# EAGLE design 32u4_Gripper_2015_A (EAGLE 6.5.0)
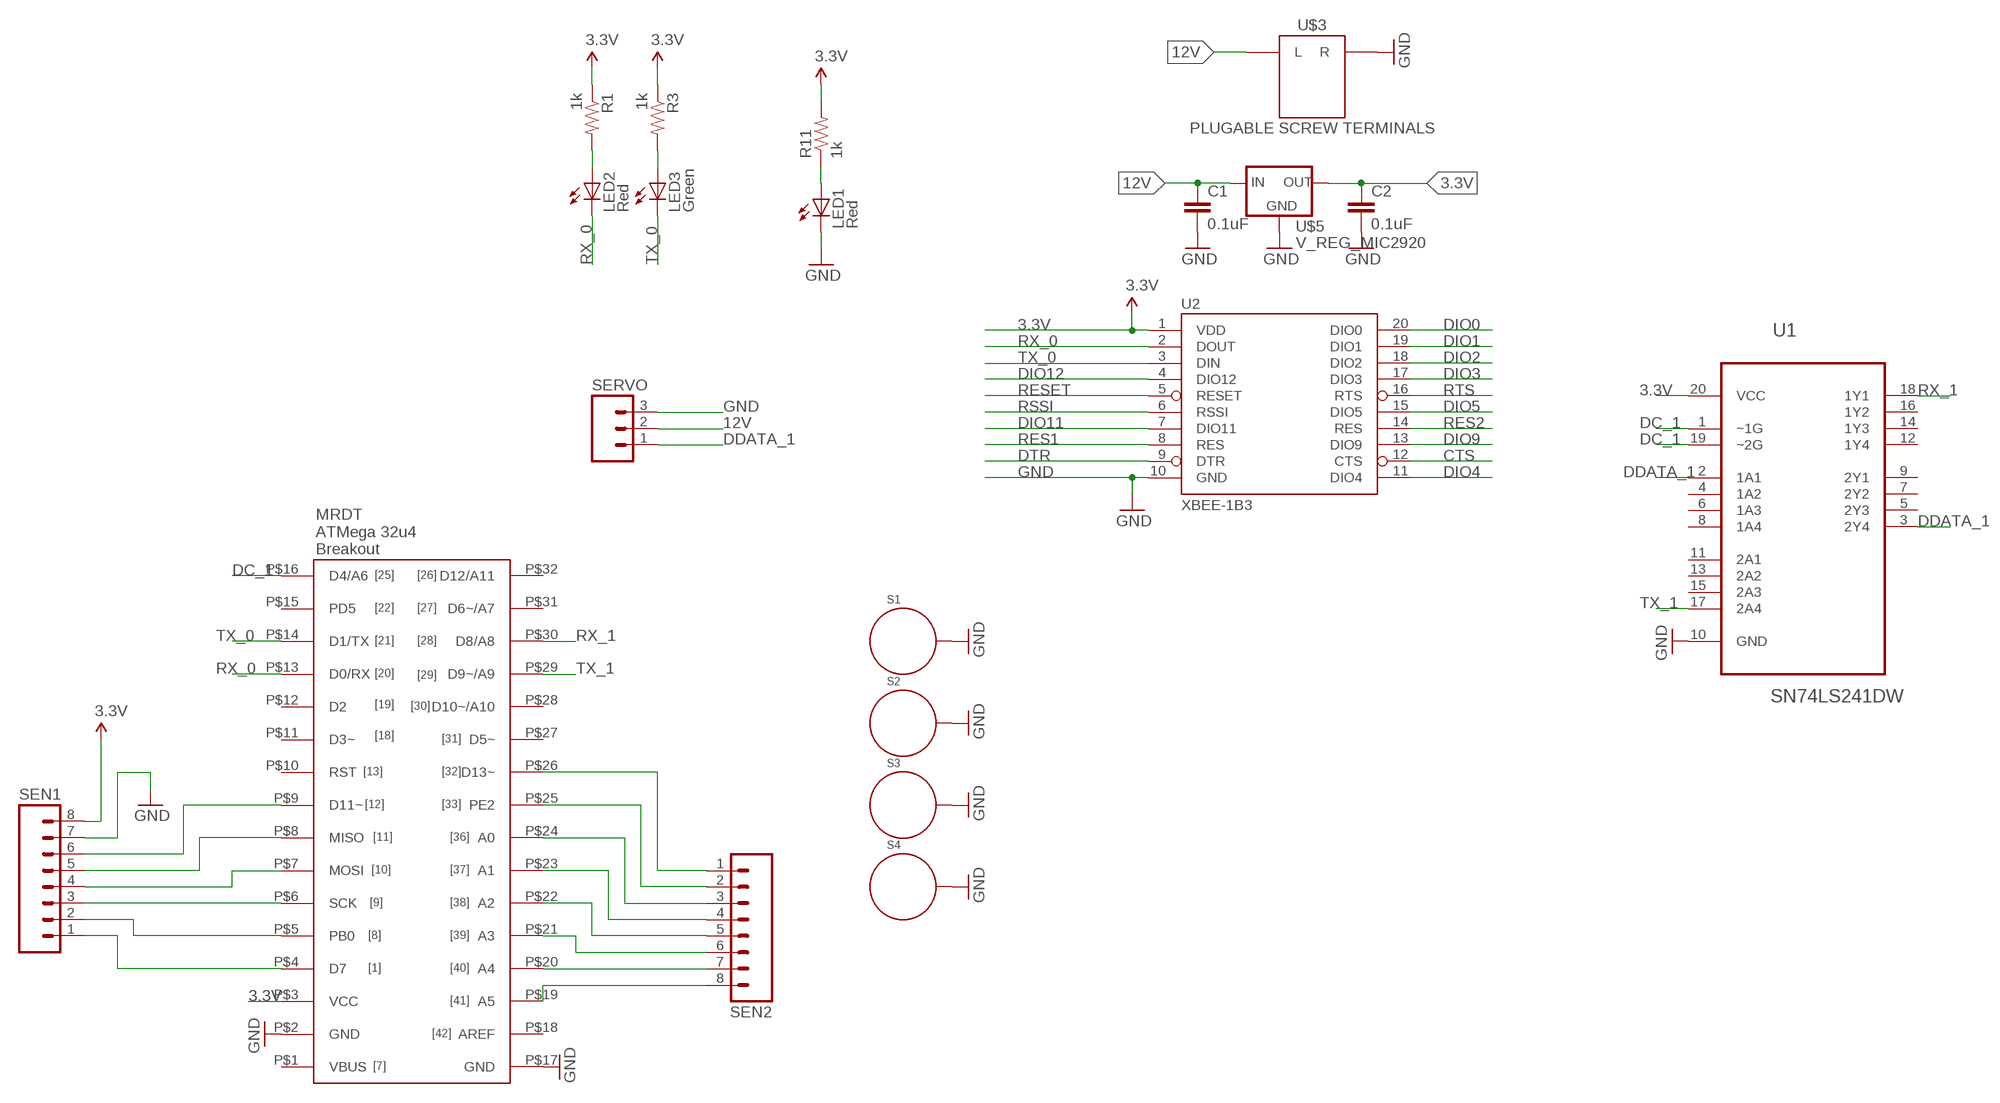
[diagram p0: schematic, sheet 1]

## Parts
C1  0.1uF  CAP1206  [1206]
C2  0.1uF  CAP1206  [1206]
LED1  Red  LED0603  [LED-0603]
LED2  Red  LED0603  [LED-0603]
LED3  Green  LED0603  [LED-0603]
R1  1k  RESISTOR1206  [1206]
R3  1k  RESISTOR1206  [1206]
R11  1k  RESISTOR1206  [1206]
S1  STANDOFF_ELECTRICAL  [STANDOFF-ELECTRICAL]
S2  STANDOFF_ELECTRICAL  [STANDOFF-ELECTRICAL]
S3  STANDOFF_ELECTRICAL  [STANDOFF-ELECTRICAL]
S4  STANDOFF_ELECTRICAL  [STANDOFF-ELECTRICAL]
SEN1  M081X08  [1X08]
SEN2  M081X08  [1X08]
SERVO  M03PTH  [1X03]
U1  SN74LS241DW  [SOIC127P1030X265-20N]
U2  XBEE-1B3  [XBEE-SMD]
U$1  32U4_BREAKOU_SMD  [32U3_MCU_DIP_SMD]
U$3  PLUGABLE SCREW TERMINALS  H_WR-TBL_3210002VERT  [691321100002]
U$5  V_REG_MIC2920  [SOT223]

## Nets
3.3V [vcc]: C2.1 R1.1 R3.1 R11.2 SEN1.8 U1.20(VCC) U2.1(VDD) U$1.P$3(VCC) U$5.3(OUT)
12V: C1.1 SERVO.2 U$3.L U$5.1(IN)
CTS: U2.12(CTS)
DC_1: U1.1(~1G) U1.19(~2G) U$1.P$16(D4/A6)
DDATA_1: SERVO.1 U1.2(1A1) U1.3(2Y4)
DIO0: U2.20(DIO0)
DIO1: U2.19(DIO1)
DIO2: U2.18(DIO2)
DIO3: U2.17(DIO3)
DIO4: U2.11(DIO4)
DIO5: U2.15(DIO5)
DIO9: U2.13(DIO9)
DIO11: U2.7(DIO11)
DIO12: U2.4(DIO12)
DTR: U2.9(DTR)
GND: C1.2 C2.2 LED1.C S1.P1 S2.P1 S3.P1 S4.P1 SEN1.7 SERVO.3 U1.10(GND) U2.10(GND) U$1.P$2(GND) U$1.P$17(GND) U$3.R U$5.2(GND) U$5.4(GND)
N$1: LED2.A R1.2
N$2: SEN1.1 U$1.P$4(D7)
N$3: SEN1.2 U$1.P$5(PB0)
N$4: LED3.A R3.2
N$5: SEN1.3 U$1.P$6(SCK)
N$6: SEN1.4 U$1.P$7(MOSI)
N$7: SEN1.5 U$1.P$8(MISO)
N$8: SEN1.6 U$1.P$9(D11~)
N$11: SEN2.8 U$1.P$19(A5)
N$12: SEN2.7 U$1.P$20(A4)
N$13: SEN2.6 U$1.P$21(A3)
N$14: SEN2.5 U$1.P$22(A2)
N$15: SEN2.3 U$1.P$24(A0)
N$16: SEN2.4 U$1.P$23(A1)
N$17: SEN2.2 U$1.P$25(PE2)
N$18: SEN2.1 U$1.P$26(D13~)
N$38: LED1.A R11.1
RES1: U2.8(RES)
RES2: U2.14(RES)
RESET: U2.5(RESET)
RSSI: U2.6(RSSI)
RTS: U2.16(RTS)
RX_0: LED2.C U2.2(DOUT) U$1.P$13(D0/RX)
RX_1: U1.18(1Y1) U$1.P$30(D8/A8)
TX_0: LED3.C U2.3(DIN) U$1.P$14(D1/TX)
TX_1: U1.17(2A4) U$1.P$29(D9~/A9)
Unconnected: U1.4(1A2) U1.5(2Y3) U1.6(1A3) U1.7(2Y2) U1.8(1A4) U1.9(2Y1) U1.11(2A1) U1.12(1Y4) U1.13(2A2) U1.14(1Y3) U1.15(2A3) U1.16(1Y2) U$1.P$1(VBUS) U$1.P$10(RST) U$1.P$11(D3~) U$1.P$12(D2) U$1.P$15(PD5) U$1.P$18(AREF) U$1.P$27(D5~) U$1.P$28(D10~/A10) U$1.P$31(D6~/A7) U$1.P$32(D12/A11)

## Library data of the parts
C1 C2 = SparkFun-Passives:CAP: Capacitor Standard 0603 ceramic capacitor, and 0.1" leaded capacitor.
LED1-LED3 = SparkFun:LED: LEDs Standard schematic elements and footprints for 5mm, 3mm, 1206, and 0603 sized LEDs. 5mm - Spark Fun Electronics SKU : COM-00529 (and others)
R1 R3 R11 = SparkFun-Passives:RESISTOR: Resistor Basic schematic elements and footprints for 0603, 1206, and PTH resistors.
S1-S4 = SparkFun-Electromechanical:STANDOFF_ELECTRICAL: A standoff intended to be an electrically connected point. Pad size and stop size allow for a #4 Phillips pan screw head to make a solid connection to the board.
SEN1 SEN2 = SparkFun-Connectors:M08: Header 8 Standard 8-pin 0.1" header. Use with straight break away headers (SKU : PRT-00116), right angle break away headers (PRT-00553), swiss pins (PRT-00743), machine pins (PRT-00117), and female headers (PRT-00115).
SERVO = SparkFun-Connectors:M03: Header 3 Standard 3-pin 0.1" header. Use with straight break away headers (SKU : PRT-00116), right angle break away headers (PRT-00553), swiss pins (PRT-00743), machine pins (PRT-00117), and female headers (PRT-00115). Molex polarized connector foot print use with SKU : PRT-08232 with associated crimp pins and housings.
U1 = 74LS241:SN74LS241DW: OCTAL BUFFERS AND LINE DRIVERS WITH 3-STATE OUTPUTS; MPN: SN74LS241DW; OC_FARNELL: 1739687; OC_NEWARK: 50R6539; PACKAGE: SOIC-20; SUPPLIER: Texas Instruments
U2 = SparkFun:XBEE-1
U$1 = MRDT-2015-General:32U4_BREAKOU_SMD
U$3 = MRDT-2015-PowerBoard:H_WR-TBL_32*1*0002: Wurth Electronic's 2-pin 10A pluggable screw terminal headers. Vertical and Horizantal Part Numbers: 691322110002 (Horizantal) 691321100002 (Vertical); DIGIKEY_PN: 732-2763-ND
U$5 = SparkFun-PowerIC:V_REG_MIC2920: MIC2920A (http://www.micrel.com/_PDF/mic2920.pdf) - 400mA output LDO Regulator

## Net classes
1 vcc: width 0.305 mm

## Board
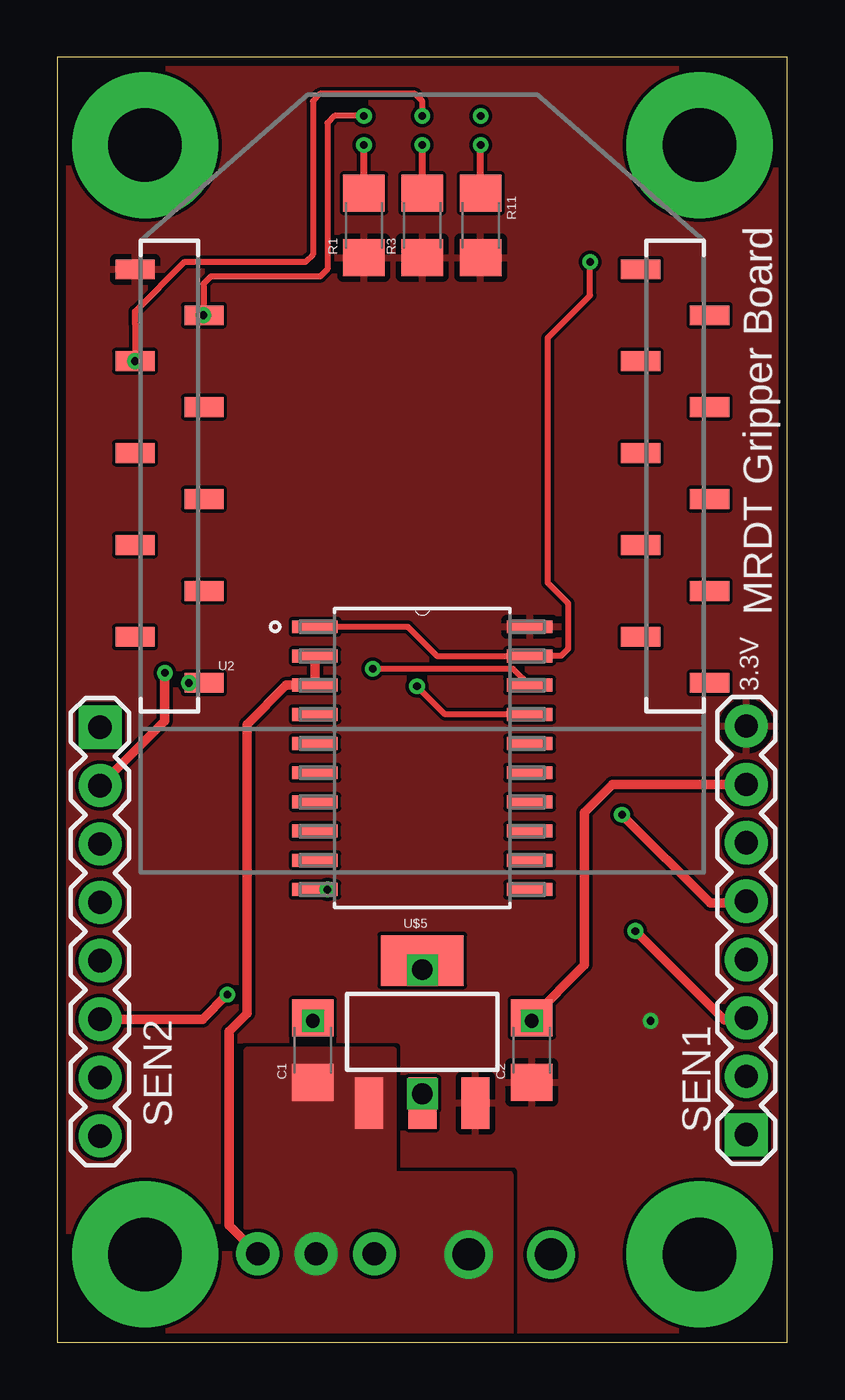
[diagram p1: board, top side]
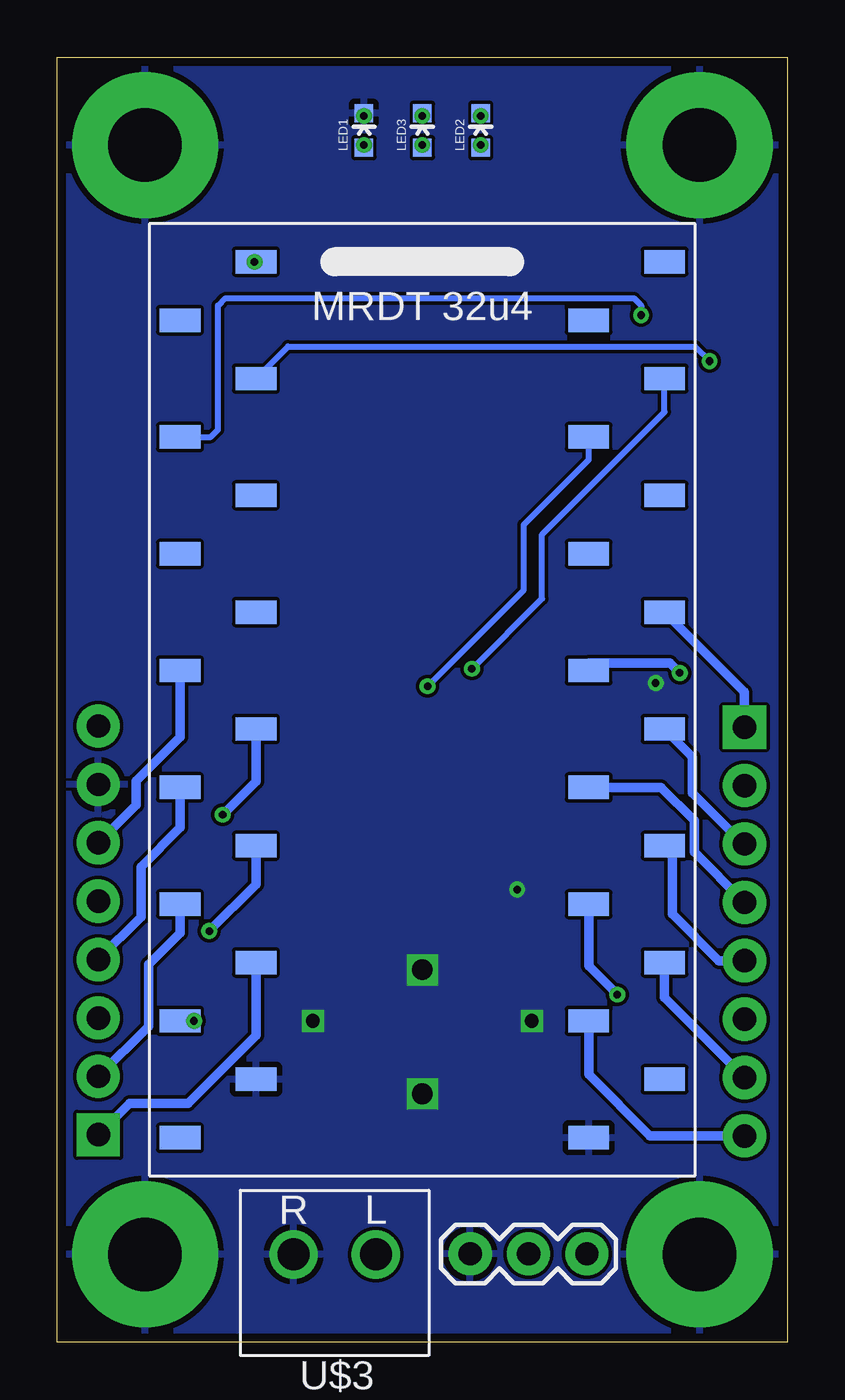
[diagram p2: board, bottom side, seen from below]

Size 31.75 x 55.88 mm. Coordinates in mm from the lower left corner, seen from the top.
Outline: 0,0 31.75,0 31.75,55.88 0,55.88 0,0
Copper layers (1*16): Top 0.0356mm / dielectric 1.5011mm / Bottom 0.0356mm
Design rules "LaenPCBOrder": minimum track width 6mil, minimum drill 13mil, track to track 6mil, track to pad 6mil, pad to pad 6mil, via to via 6mil, smd to smd 6mil, copper to edge 15mil, drill to drill 6mil, minimum pad ring 7mil, minimum via ring 7mil, stop-mask expansion 3mil, vias tented up to drill 0mil, thermal gap 10mil

### Footprints (pad centres in the part's own frame; a part is rotated, then mirrored left to right if it is on the bottom)
1206 = smd 1.6 x 1.8: 1 -1.4,0; 2 1.4,0
LED-0603 = smd 0.8 x 0.8: A 0,-0.75; C 0,0.75
STANDOFF-ELECTRICAL = drill 3.2 pad 6.35: P1 0,0
1X08 = drill 1.016 pad 1.88 square: 1 0,0 | drill 1.016 pad 1.88: 2 2.54,0; 3 5.08,0; 4 7.62,0; 5 10.16,0; 6 12.7,0; 7 15.24,0; 8 17.78,0
1X03 = drill 1.016 pad 1.88: 1 0,0; 2 2.54,0; 3 5.08,0
SOIC127P1030X265-20N = smd 1.981 x 0.559: 1 -4.674,5.715; 2 -4.674,4.445; 3 -4.674,3.175; 4 -4.674,1.905; 5 -4.674,0.635; 6 -4.674,-0.635; 7 -4.674,-1.905; 8 -4.674,-3.175; 9 -4.674,-4.445; 10 -4.674,-5.715; 11 4.674,-5.715; 12 4.674,-4.445; 13 4.674,-3.175; 14 4.674,-1.905; 15 4.674,-0.635; 16 4.674,0.635; 17 4.674,1.905; 18 4.674,3.175; 19 4.674,4.445; 20 4.674,5.715
XBEE-SMD = smd 1.7 x 0.85: 1 -12.5,20; 2 -9.5,18; 3 -12.5,16; 4 -9.5,14; 5 -12.5,12; 6 -9.5,10; 7 -12.5,8; 8 -9.5,6; 9 -12.5,4; 10 -9.5,2; 11 12.5,2; 12 9.5,4; 13 12.5,6; 14 9.5,8; 15 12.5,10; 16 9.5,12; 17 12.5,14; 18 9.5,16; 19 12.5,18; 20 9.5,20
32U3_MCU_DIP_SMD = smd 1.778 x 1.016: P$1 -10.541,-19.05; P$2 -7.239,-16.51; P$3 -10.541,-13.97; P$4 -7.239,-11.43; P$5 -10.541,-8.89; P$6 -7.239,-6.35; P$7 -10.541,-3.81; P$8 -7.239,-1.27; P$9 -10.541,1.27; P$10 -7.239,3.81; P$11 -10.541,6.35; P$12 -7.239,8.89; P$13 -10.541,11.43; P$14 -7.239,13.97; P$15 -10.541,16.51; P$16 -7.239,19.05; P$17 7.239,-19.05; P$18 10.541,-16.51; P$19 7.239,-13.97; P$20 10.541,-11.43; P$21 7.239,-8.89; P$22 10.541,-6.35; P$23 7.239,-3.81; P$24 10.541,-1.27; P$25 7.239,1.27; P$26 10.541,3.81; P$27 7.239,6.35; P$28 10.541,8.89; P$29 7.239,11.43; P$30 10.541,13.97; P$31 7.239,16.51; P$32 10.541,19.05
691321100002 = drill 1.4: L -1.79,0; R 1.79,0
SOT223 = smd 1.219 x 2.235: 1 -2.311,-3.099; 2 0,-3.099; 3 2.311,-3.099 | smd 3.6 x 2.2: 4 0,3.099

### Placement (x,y rotation side)
C1  11.11,12.7 90 top
C2  20.64,12.7 90 top
LED1  18.41,52.7 0 bottom
LED2  13.34,52.7 0 bottom
LED3  15.88,52.7 0 bottom
R1  13.34,48.58 90 top
R3  15.88,48.58 90 top
R11  18.41,48.58 270 top
S1  3.81,52.07 0 top
S2  27.94,52.07 0 top
S3  3.81,3.81 0 top
S4  27.94,3.81 0 top
SEN1  29.97,9.02 90 top
SEN2  1.85,26.75 270 top
SERVO  8.71,3.84 180 bottom
U1  15.88,25.4 0 top
U2  15.88,26.67 0 top
U$1  15.88,27.94 0 bottom
U$3  19.68,3.81 180 bottom
U$5  15.88,13.49 0 top

### Tracks (layer width: path | path; a pad name or v marks a point on that pad's centre or on a via)
3.3V  (via drill 0.33)
  Bottom 0.305: v25.81,13.97 U$1.P$3
  pour Top (isolate 0.152, rank 2): -1.27,-1.27 -1.27,57.15 33.02,57.15 33.02,-1.27
12V
  pour Top (isolate 0.152, no thermals): 0,0 0,3.81 8.26,3.81 8.26,12.7 14.61,12.7 14.61,7.3 19.68,7.3 19.68,0
DC_1  (via drill 0.33)
  Top 0.254: U1.1 15.24,31.11 16.51,29.84 U1.19 21.91,29.84 22.23,30.16 22.23,32.13 21.34,33.02 21.34,43.69 23.18,45.53 v23.18,46.99
  Bottom 0.254: v23.18,46.99 23.18,46.93 U$1.P$16
DDATA_1
  Top 0.406: U1.2 U1.3 9.96,28.57 8.26,26.87 8.26,14.3 7.47,13.51 7.47,5.08 SERVO.1
GND  (via drill 0.33, 0.6, 0.9)
  Top 0.406: U2.10 v5.71,28.67 | U1.10 v11.75,19.68 | 14.92,16.19 14.92,16.51 15.24,16.51 15.24,16.59 U$5.4 v15.88,16.19 | U$5.2 v15.88,10.79 | C1.2 v11.11,13.97 | v20.64,13.97 C2.2 22.94,16.4 22.94,23.04 24.16,24.26 SEN1.7
  Bottom 0.406: LED1.C v18.41,53.34
  pour Bottom (isolate 0.152): -3.81,-2.54 -3.81,58.42 35.56,58.42 35.56,-2.54
N$1  (via drill 0.33)
  Top 0.305: R1.2 v13.34,52.07
  Bottom 0.305: v13.34,52.07 LED2.A
N$2
  Bottom 0.406: U$1.P$4 23.11,13.34 26.06,10.39 28.6,10.39 SEN1.1
N$3
  Bottom 0.406: SEN1.2 27.79,13.74 27.79,16.43 26.42,17.8 U$1.P$5
N$4  (via drill 0.33)
  Top 0.305: R3.2 v15.88,52.07
  Bottom 0.305: v15.88,52.07 LED3.A
N$5  (via drill 0.33)
  Top 0.406: v25.15,17.88 29.01,14.02 29.9,14.02 SEN1.3
  Bottom 0.406: v25.15,17.88 23.11,19.91 U$1.P$6
N$6
  Bottom 0.406: U$1.P$7 26.42,22.38 28.12,20.68 28.12,18.49 SEN1.4
N$7  (via drill 0.33)
  Top 0.406: v24.56,22.94 28.4,19.1 29.9,19.1 SEN1.5
  Bottom 0.406: 23.09,26.64 U$1.P$8 23.11,24.38 v24.56,22.94
N$8
  Bottom 0.406: U$1.P$9 26.42,26.31 28.32,24.41 28.32,23.37 SEN1.6
N$11
  Bottom 0.406: SEN2.8 5.97,8.97 8.64,11.63 U$1.P$19
N$12
  Bottom 0.406: SEN2.7 5.33,14.99 U$1.P$20
N$13  (via drill 0.33)
  Top 0.406: v7.39,15.11 6.33,14.05 SEN2.6
  Bottom 0.406: U$1.P$21 8.64,16.36 v7.39,15.11
N$14
  Bottom 0.406: SEN2.5 2.97,16.59 5,18.62 5,21.26 U$1.P$22
N$15
  Bottom 0.406: U$1.P$24 4.12,25.45 4.12,23.88 1.91,21.67 SEN2.3
N$16
  Bottom 0.406: U$1.P$23 5.49,24.13 4.04,22.68 4.04,21.31 SEN2.4
N$17  (via drill 0.33)
  Top 0.406: SEN2.2 4.67,27.03 v4.67,29.11
  Bottom 0.406: U$1.P$25 8.64,29.54 5.11,29.54 v4.67,29.11
N$18
  Bottom 0.406: U$1.P$26 1.85,28.27 SEN2.1
N$38  (via drill 0.33)
  Top 0.305: R11.1 v18.41,52.07
  Bottom 0.305: v18.41,52.07 LED1.A
RX_0  (via drill 0.33)
  Top 0.254: v6.35,44.67 U2.2 6.35,44.7 6.35,46.04 6.67,46.35 11.43,46.35 11.75,46.67 11.75,53.02 12.06,53.34 v13.34,53.34
  Bottom 0.254: U$1.P$13 25.08,39.37 24.77,39.69 24.77,45.09 24.45,45.4 6.67,45.4 6.35,45.09 v6.35,44.67 | LED2.C 13.13,53.45 v13.34,53.34
RX_1  (via drill 0.33)
  Top 0.254: U1.18 19.84,29.29 v13.72,29.29
  Bottom 0.254: v13.72,29.29 10.67,32.33 10.67,35.13 5.33,40.46 U$1.P$30
TX_0  (via drill 0.33)
  Top 0.254: 3.5,42.55 U2.3 3.38,44.29 3.38,44.3 3.38,44.83 5.54,46.99 10.79,46.99 11.11,47.31 11.11,53.98 11.43,54.29 15.56,54.29 15.88,53.98 v15.88,53.34
  Bottom 0.254: 23.11,42.29 U$1.P$14 21.72,43.31 4.01,43.31 U2.3 | LED3.C v15.88,53.34
  other vias: 3.38,42.67
TX_1  (via drill 0.33)
  Top 0.254: U1.17 16.87,27.3 v15.65,28.52
  Bottom 0.254: v15.65,28.52 11.46,32.72 11.46,35.56 8.64,38.38 U$1.P$29

### Text on the board
tPlace: MRDT Gripper Board | 3.3V